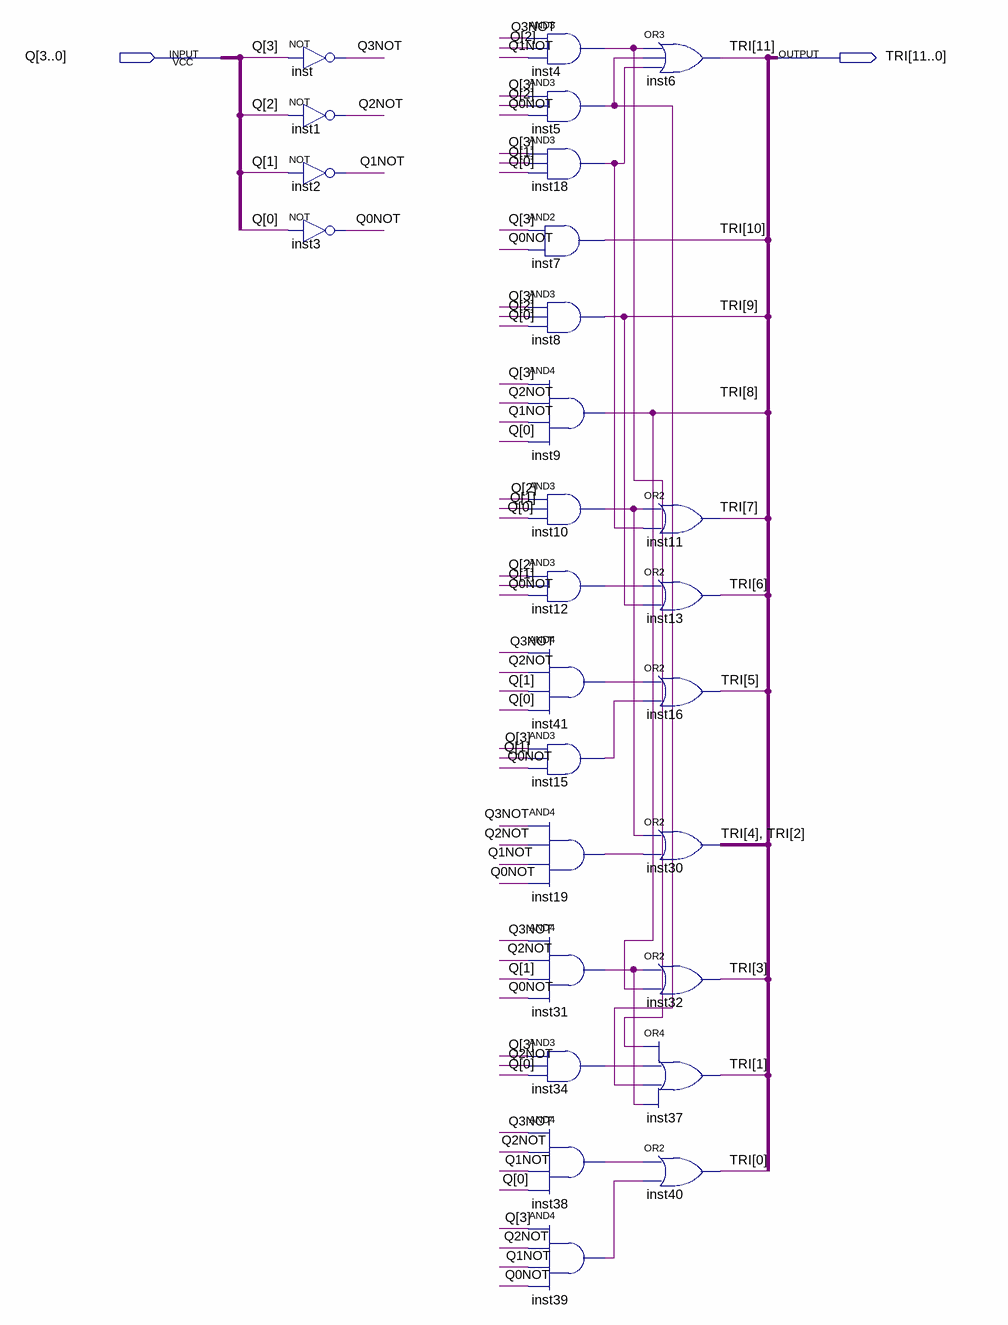
[diagram p0: schematic sheet]
// Quartus schematic DECODE_TRI.bdf as structural Verilog: 27 symbols, 2 pins
module DECODE_TRI (
  input  [3:0] Q,
  output [11:0] TRI
);

  wire inst4_out, inst5_out, inst10_out, inst12_out, inst15_out, inst18_out, inst19_out, inst31_out,
       inst34_out, inst38_out, inst39_out, inst41_out, Q0NOT, Q1NOT, Q2NOT, Q3NOT;

  not inst (Q3NOT, Q[3]);
  not inst1 (Q2NOT, Q[2]);
  not inst2 (Q1NOT, Q[1]);
  not inst3 (Q0NOT, Q[0]);
  and inst4 (inst4_out, Q3NOT, Q[2], Q1NOT);
  and inst5 (inst5_out, Q[3], Q[2], Q0NOT);
  and inst18 (inst18_out, Q[3], Q[1], Q[0]);
  and inst7 (TRI[10], Q[3], Q0NOT);
  and inst8 (TRI[9], Q[3], Q[2], Q[0]);
  and inst9 (TRI[8], Q[3], Q2NOT, Q1NOT, Q[0]);
  and inst10 (inst10_out, Q[2], Q[1], Q[0]);
  and inst12 (inst12_out, Q[2], Q[1], Q0NOT);
  and inst41 (inst41_out, Q3NOT, Q2NOT, Q[1], Q[0]);
  and inst15 (inst15_out, Q[3], Q[1], Q0NOT);
  and inst19 (inst19_out, Q3NOT, Q2NOT, Q1NOT, Q0NOT);
  and inst31 (inst31_out, Q3NOT, Q2NOT, Q[1], Q0NOT);
  and inst34 (inst34_out, Q[3], Q2NOT, Q[0]);
  and inst38 (inst38_out, Q3NOT, Q2NOT, Q1NOT, Q[0]);
  and inst39 (inst39_out, Q[3], Q2NOT, Q1NOT, Q0NOT);
  or inst6 (TRI[11], inst4_out, inst5_out, inst18_out);
  or inst11 (TRI[7], inst10_out, inst18_out);
  or inst13 (TRI[6], inst12_out, TRI[9]);
  or inst16 (TRI[5], inst41_out, inst15_out);
  assign {TRI[4], TRI[2]} = {2{inst10_out}} | {2{inst19_out}};  // OR2 inst30, 2 bits wide
  or inst32 (TRI[3], inst31_out, TRI[8]);
  or inst37 (TRI[1], inst4_out, inst34_out, inst5_out, inst31_out);
  or inst40 (TRI[0], inst38_out, inst39_out);
endmodule
